# EAGLE design ll_both (EAGLE 8.0.2)
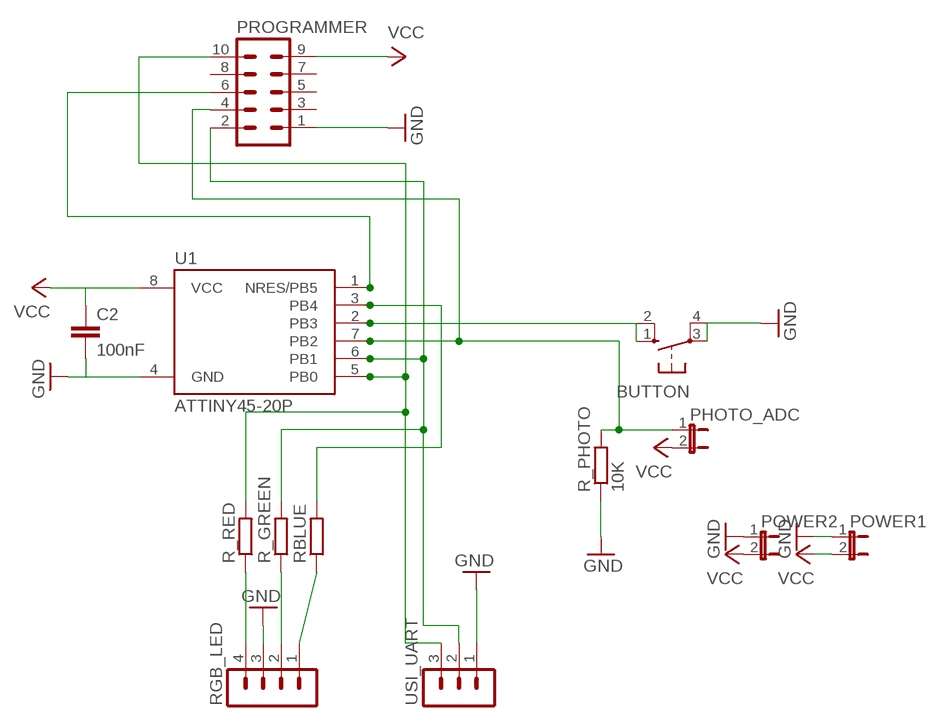
[diagram p0: schematic, sheet 1]

## Parts
BUTTON  10-XX  [B3F-10XX]
C2  100nF  C-EU025-025X050  [C025-025X050]
PHOTO_ADC  JP1E  [JP1]
POWER1  JP1E  [JP1]
POWER2  JP1E  [JP1]
PROGRAMMER  MA05-2  [MA05-2]
R_GREEN  R-EU_0204/7  [0204/7]
R_PHOTO  10K  R-EU_0204/7  [0204/7]
R_RED  R-EU_0204/7  [0204/7]
RBLUE  R-EU_0204/7  [0204/7]
RGB_LED  MA04-1  [MA04-1]
U1  ATTINY45-20P  [PDIP08_300MIL]
USI_UART  MA03-1  [MA03-1]

## Nets
GND: BUTTON.3(P) BUTTON.4(P1) C2.2 POWER1.1 POWER2.1 PROGRAMMER.1 R_PHOTO.1 RGB_LED.3 U1.4(GND) USI_UART.1
MISO: PROGRAMMER.2 R_GREEN.2 U1.6(PB1) USI_UART.2
MOSI: PROGRAMMER.10 R_RED.2 U1.5(PB0) USI_UART.3
N$2: R_GREEN.1 RGB_LED.2
N$4: R_RED.1 RGB_LED.4
N$5: RBLUE.2 U1.3(PB4)
N$6: RBLUE.1 RGB_LED.1
N$8: BUTTON.1(S) BUTTON.2(S1) U1.2(PB3)
RESET: PROGRAMMER.6 U1.1(NRES/PB5)
SCK: PHOTO_ADC.1 PROGRAMMER.4 R_PHOTO.2 U1.7(PB2)
VCC: C2.1 PHOTO_ADC.2 POWER1.2 POWER2.2 PROGRAMMER.9 U1.8(VCC)
Unconnected: PROGRAMMER.3 PROGRAMMER.5 PROGRAMMER.7 PROGRAMMER.8

## Library data of the parts
BUTTON = switch-omron:10-XX: OMRON SWITCH; MPN: B3F-1000; OC_FARNELL: 176432; OC_NEWARK: 36M3542
C2 = rcl:C-EU: CAPACITOR, European symbol
PHOTO_ADC POWER1 POWER2 = jumper:JP1E: JUMPER
PROGRAMMER = con-lstb:MA05-2: PIN HEADER; OC_FARNELL: unknown; OC_NEWARK: unknown
R_GREEN R_PHOTO R_RED RBLUE = rcl:R-EU_: RESISTOR, European symbol
RGB_LED = con-lstb:MA04-1: PIN HEADER; OC_FARNELL: unknown; OC_NEWARK: unknown
U1 = attiny25_45_85:ATTINY45*: ATMEL ATtiny 45 Packages: P = PDIP 08 30mil S = SOIC 08 EIAJ 208mil X = TSSOP 08 4.4mm Technologies Note: for complete ordering code (temp. range, finish, tape&reel etc.) see www.atmel.com • Supply Voltage: V = (1.8…5.5)V | [blank] = (2.7…5.5)V • Speed: 10 = 10 MHz | 20 = 20 MHz Author: Dipl.-Ing. FH Rainer Bayer HHN Hochschule Heilbronn (Heilbronn University), rainer.bayer@hs-heilbronn.de Ingenieurbüro ing-rb, mail@ing-rb.de
USI_UART = con-lstb:MA03-1: PIN HEADER; OC_FARNELL: unknown; OC_NEWARK: unknown

## Board
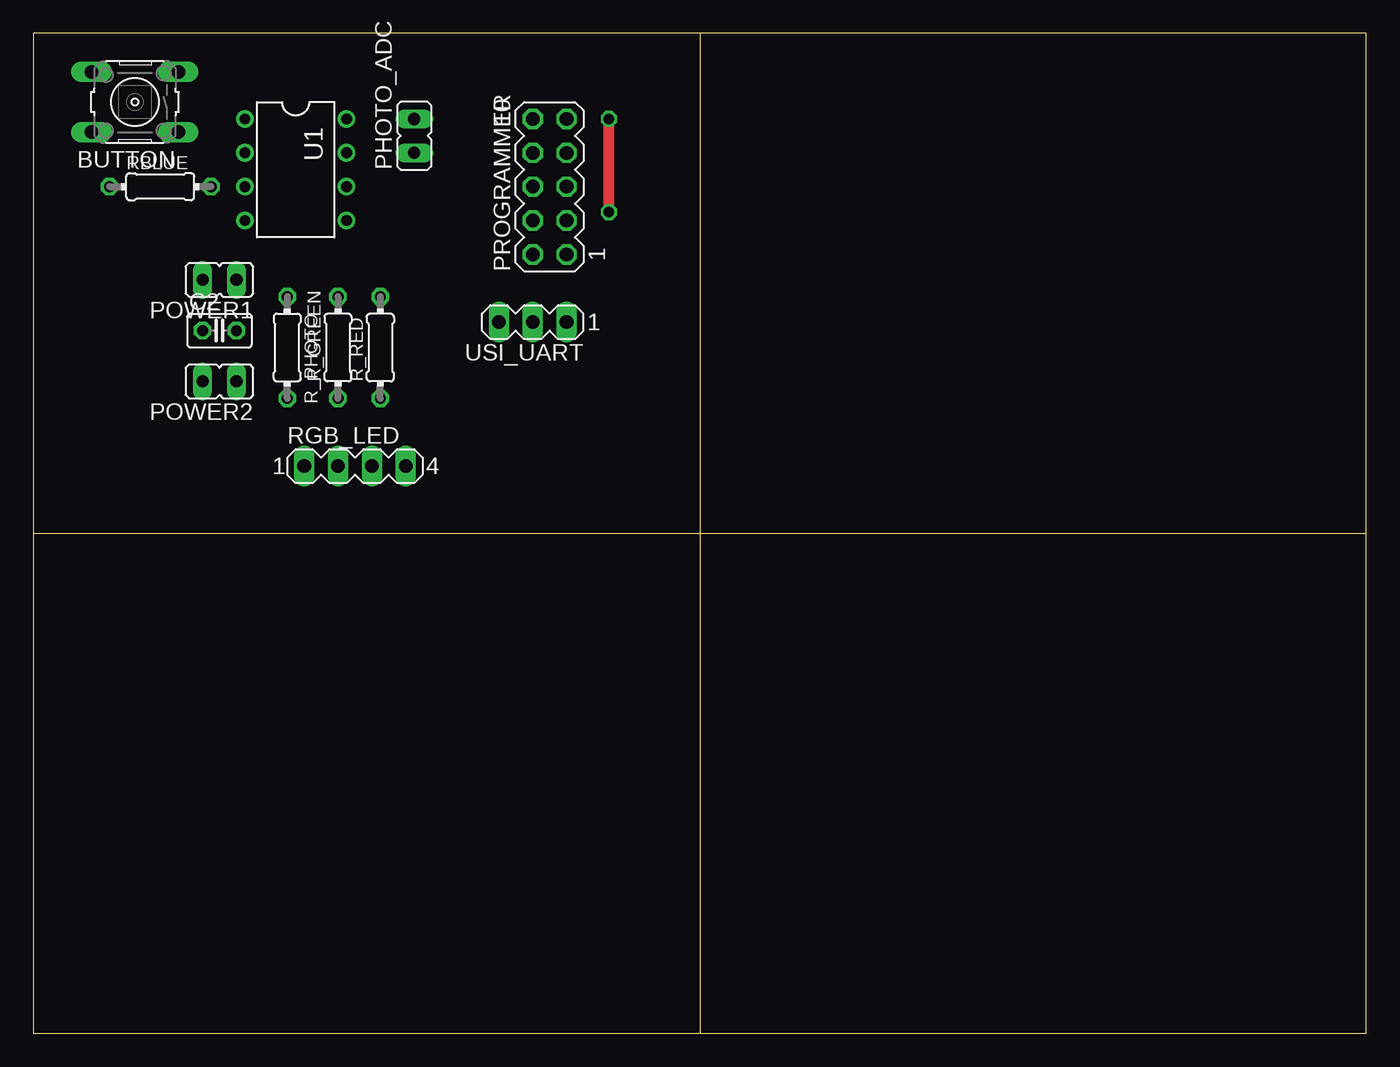
[diagram p1: board, top side]
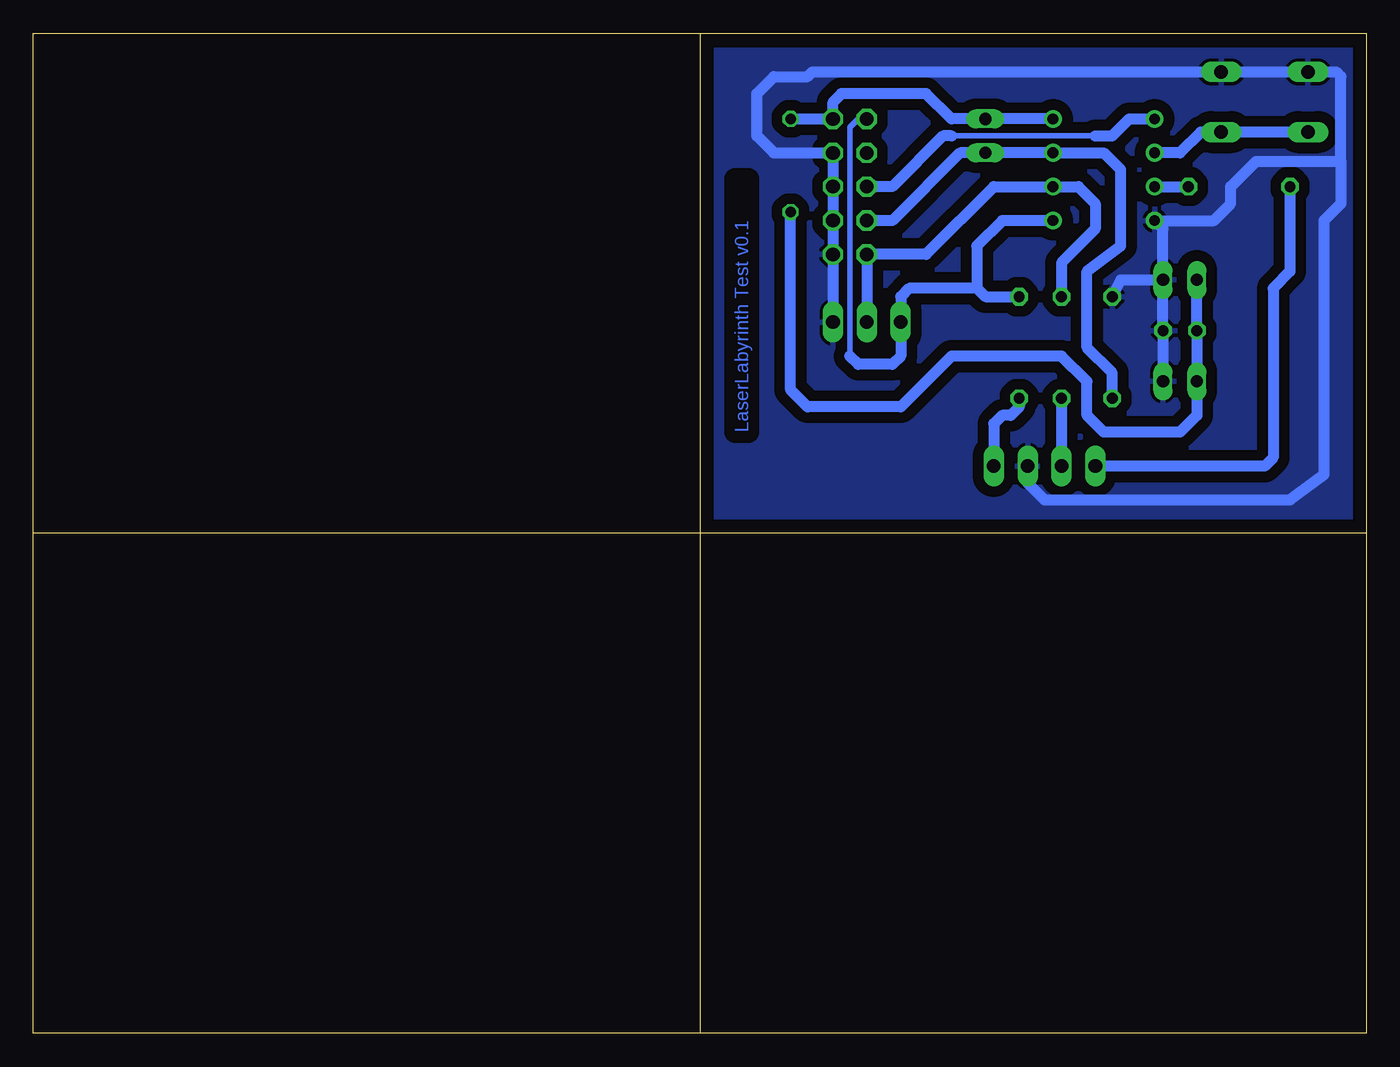
[diagram p2: board, bottom side, seen from below]

Size 100 x 75 mm. Coordinates in mm from the lower left corner, seen from the top.
Outline: 50,0 0,0 0,37.5
Outline: 50,0 100,0 100,37.5
Outline: 100,37.5 100,75 50,75
Outline: 50,75 0,75 0,37.5
Outline: 0,37.5 50,37.5
Outline: 50,37.5 100,37.5
Outline: 50,75 50,37.5
Outline: 50,37.5 50,0
Copper layers (1*16): Top 0.035mm / dielectric 1.5mm / Bottom 0.035mm
Design rules "default": minimum track width 10mil, minimum drill 24mil, track to track 8mil, track to pad 8mil, pad to pad 8mil, via to via 8mil, smd to smd 8mil, copper to edge 40mil, drill to drill 8mil, minimum pad ring 10mil, minimum via ring 8mil, stop-mask expansion 4mil, vias tented up to drill 0mil, thermal gap 10mil

### Footprints (pad centres in the part's own frame; a part is rotated, then mirrored left to right if it is on the bottom)
B3F-10XX = drill 1.016 long: 1 -3.251,2.261; 2 3.251,2.261; 3 -3.251,-2.261; 4 3.251,-2.261
C025-025X050 = drill 0.813 octagon: 1 -1.27,0; 2 1.27,0
JP1 = drill 0.914 long: 1 0,-1.27; 2 0,1.27
MA05-2 = drill 1.016 octagon: 1 -5.08,-1.27; 2 -5.08,1.27; 3 -2.54,-1.27; 4 -2.54,1.27; 5 0,-1.27; 6 0,1.27; 7 2.54,-1.27; 8 2.54,1.27; 9 5.08,-1.27; 10 5.08,1.27
0204/7 = drill 0.813 octagon: 1 -3.81,0; 2 3.81,0
MA04-1 = drill 1.016 long: 1 -3.81,0; 2 -1.27,0; 3 1.27,0; 4 3.81,0
PDIP08_300MIL = drill 0.813: 1 -3.81,-3.81; 2 -1.27,-3.81; 3 1.27,-3.81; 4 3.81,-3.81; 5 3.81,3.81; 6 1.27,3.81; 7 -1.27,3.81; 8 -3.81,3.81
MA03-1 = drill 1.016 long: 1 -2.54,0; 2 0,0; 3 2.54,0

### Placement (x,y rotation side)
BUTTON  7.62,69.85 180 top
C2  13.97,52.7 0 top
PHOTO_ADC  28.57,67.31 0 top
POWER1  13.97,56.52 90 top
POWER2  13.97,48.9 90 top
PROGRAMMER  38.73,63.5 90 top
R_GREEN  22.86,51.44 90 top
R_PHOTO  19.05,51.44 270 top
R_RED  26.04,51.44 90 top
RBLUE  9.53,63.5 0 top
RGB_LED  24.13,42.55 0 top
U1  19.68,64.77 270 top
USI_UART  37.47,53.34 180 top

### Tracks (layer width: path | path; a pad name or v marks a point on that pad's centre or on a via)
GND
  Bottom 0.813: USI_UART.1 PROGRAMMER.1 40.01,66.04 44.45,66.04 45.72,67.31 45.72,70.48 44.45,71.75 41.91,71.75 41.55,72.11 BUTTON.3 BUTTON.4 2.26,72.11 1.91,71.75 1.91,65.41 | POWER2.1 C2.2 POWER1.1 | R_PHOTO.1 18.41,56.52 POWER1.1 | 1.91,65.41 1.91,62.23 3.17,60.96 3.17,41.91 5.71,40.01 24.13,40.01 25.4,41.27 RGB_LED.3 | POWER1.1 15.24,60.33 U1.4 11.43,60.96 10.16,62.23 10.16,63.5 8.26,65.41 1.91,65.41
  pour Bottom (isolate 0.813): 1,38.5 49,38 49,74 1,74
MISO
  Bottom 0.813: USI_UART.2 PROGRAMMER.2 33.02,58.42 27.94,63.5 U1.6 21.59,63.5 20.32,62.23 20.32,60.33 22.86,57.78 R_GREEN.2
MOSI
  Bottom 0.406: 38.73,50.8 38.73,67.94 38.1,68.58 PROGRAMMER.10
  Bottom 0.813: U1.5 27.3,60.96 29.21,59.05 29.21,55.88 | 29.21,55.88 28.57,55.24 R_RED.2 | 29.21,55.88 34.29,55.88 34.92,55.24 USI_UART.3 34.92,50.8 35.56,50.16 38.1,50.16 38.73,50.8
N$2
  Bottom 0.813: R_GREEN.1 RGB_LED.2
N$4
  Bottom 0.813: R_RED.1 26.04,46.99 26.67,46.35 27.3,46.35 27.94,45.72 RGB_LED.4
N$5
  Bottom 0.813: U1.3 RBLUE.2
N$6
  Bottom 0.813: RBLUE.1 5.71,57.15 6.99,55.88 6.99,43.18 7.62,42.55 RGB_LED.1
N$8
  Bottom 0.813: BUTTON.2 BUTTON.1 12.42,67.59 13.97,66.04 U1.2
RESET
  Bottom 0.406: 20.32,67.31 31.11,67.31
  Bottom 0.813: PROGRAMMER.6 35.56,63.5 31.75,67.31 31.11,67.31 | 20.32,67.31 19.05,67.31 17.78,68.58 U1.1
SCK
  Bottom 0.813: PROGRAMMER.4 35.56,60.96 30.48,66.04 PHOTO_ADC.1 U1.7 19.68,66.04 18.41,64.77 18.41,59.05 20.95,57.15 20.95,51.44 19.05,49.53 R_PHOTO.2
VCC  (via drill 0.8)
  Top 0.813: v43.18,61.59 v43.18,68.58
  Bottom 0.813: POWER1.2 C2.1 POWER2.2 12.7,46.35 13.97,45.09 19.68,45.09 20.95,46.35 20.95,48.9 22.86,50.8 31.11,50.8 34.92,46.99 41.91,46.99 43.18,48.26 v43.18,61.59 | U1.8 PHOTO_ADC.2 31.11,68.58 33.02,70.48 39.37,70.48 40.01,69.85 PROGRAMMER.9 v43.18,68.58

### Text on the board
Bottom: LaserLabyrinth Test v0.1